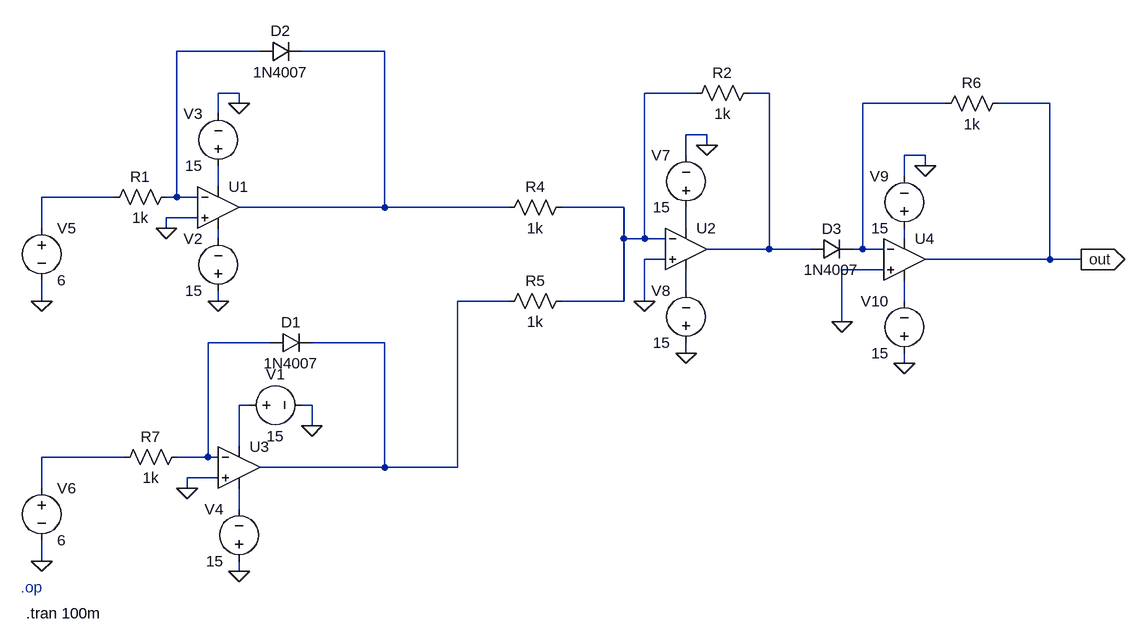
[diagram p0: schematic Day6_Analog Multiplier_OpAmp.asc]
Day6_Analog Multiplier_OpAmp.asc, the LTspice schematic file:
Version 4.1
SHEET 1 1520 784
WIRE 160 -96 32 -96
WIRE 352 -96 224 -96
WIRE 128 -32 96 -32
WIRE 832 -32 752 -32
WIRE 944 -32 912 -32
WIRE 128 -16 128 -32
WIRE 1216 -16 1088 -16
WIRE 1376 -16 1296 -16
WIRE 96 0 96 -32
WIRE 848 32 816 32
WIRE 848 48 848 32
WIRE 816 64 816 32
WIRE 1184 64 1152 64
WIRE 1184 80 1184 64
WIRE 1152 96 1152 64
WIRE 96 112 96 80
WIRE -64 128 -176 128
WIRE 32 128 32 -96
WIRE 32 128 16 128
WIRE 64 128 32 128
WIRE 352 144 352 -96
WIRE 352 144 128 144
WIRE 544 144 352 144
WIRE 720 144 624 144
WIRE 64 160 16 160
WIRE -176 176 -176 128
WIRE 16 176 16 160
WIRE 816 176 816 144
WIRE 96 192 96 176
WIRE 720 192 720 144
WIRE 752 192 752 -32
WIRE 752 192 720 192
WIRE 784 192 752 192
WIRE 1152 192 1152 176
WIRE 944 208 944 -32
WIRE 944 208 848 208
WIRE 1008 208 944 208
WIRE 1088 208 1088 -16
WIRE 1088 208 1072 208
WIRE 1120 208 1088 208
WIRE 784 224 752 224
WIRE 1376 224 1376 -16
WIRE 1376 224 1184 224
WIRE 1424 224 1376 224
WIRE 1120 240 1056 240
WIRE 816 272 816 240
WIRE -176 288 -176 256
WIRE 96 288 96 272
WIRE 544 288 464 288
WIRE 720 288 720 192
WIRE 720 288 624 288
WIRE 752 288 752 224
WIRE 1152 288 1152 256
WIRE 1056 320 1056 240
WIRE 176 352 80 352
WIRE 352 352 240 352
WIRE 816 368 816 352
WIRE 1152 384 1152 368
WIRE 144 448 128 448
WIRE 240 448 224 448
WIRE 240 480 240 448
WIRE 128 512 128 448
WIRE -48 528 -176 528
WIRE 80 528 80 352
WIRE 80 528 32 528
WIRE 96 528 80 528
WIRE 352 544 352 352
WIRE 352 544 160 544
WIRE 464 544 464 288
WIRE 464 544 352 544
WIRE 96 560 48 560
WIRE -176 576 -176 528
WIRE 48 576 48 560
WIRE 128 608 128 576
WIRE -176 688 -176 656
WIRE 128 704 128 688
FLAG 128 -16 0
FLAG 16 176 0
FLAG 128 704 0
FLAG 48 576 0
FLAG 240 480 0
FLAG -176 288 0
FLAG -176 688 0
FLAG 96 288 0
FLAG 848 48 0
FLAG 752 288 0
FLAG 816 368 0
FLAG 1424 224 out
IOPIN 1424 224 Out
FLAG 1184 80 0
FLAG 1152 384 0
FLAG 1056 320 0
SYMBOL OpAmps\\UniversalOpAmp2 96 144 R0
SYMATTR InstName U1
SYMBOL res 32 112 R90
WINDOW 0 0 56 VBottom 2
WINDOW 3 32 56 VTop 2
SYMATTR InstName R1
SYMATTR Value 1k
SYMBOL voltage 96 96 R180
WINDOW 0 24 96 Left 2
WINDOW 3 24 16 Left 2
WINDOW 123 0 0 Left 0
WINDOW 39 0 0 Left 0
SYMATTR InstName V3
SYMATTR Value 15
SYMBOL OpAmps\\UniversalOpAmp2 128 544 R0
SYMATTR InstName U3
SYMBOL voltage 128 704 R180
WINDOW 0 24 96 Left 2
WINDOW 3 24 16 Left 2
WINDOW 123 0 0 Left 0
WINDOW 39 0 0 Left 0
SYMATTR InstName V4
SYMATTR Value 15
SYMBOL res 48 512 R90
WINDOW 0 0 56 VBottom 2
WINDOW 3 32 56 VTop 2
SYMATTR InstName R7
SYMATTR Value 1k
SYMBOL voltage 128 448 R270
WINDOW 0 32 56 VTop 2
WINDOW 3 -32 56 VBottom 2
WINDOW 123 0 0 Left 0
WINDOW 39 0 0 Left 0
SYMATTR InstName V1
SYMATTR Value 15
SYMBOL res 640 272 R90
WINDOW 0 0 56 VBottom 2
WINDOW 3 32 56 VTop 2
SYMATTR InstName R5
SYMATTR Value 1k
SYMBOL voltage -176 160 R0
WINDOW 123 0 0 Left 0
WINDOW 39 0 0 Left 0
SYMATTR InstName V5
SYMATTR Value 6
SYMBOL voltage -176 560 R0
WINDOW 123 0 0 Left 0
WINDOW 39 0 0 Left 0
SYMATTR InstName V6
SYMATTR Value 6
SYMBOL diode 176 368 R270
WINDOW 0 32 32 VTop 2
WINDOW 3 0 32 VBottom 2
SYMATTR InstName D1
SYMATTR Value 1N4007
SYMBOL voltage 96 288 R180
WINDOW 0 24 96 Left 2
WINDOW 3 24 16 Left 2
WINDOW 123 0 0 Left 0
WINDOW 39 0 0 Left 0
SYMATTR InstName V2
SYMATTR Value 15
SYMBOL res 640 128 R90
WINDOW 0 0 56 VBottom 2
WINDOW 3 32 56 VTop 2
SYMATTR InstName R4
SYMATTR Value 1k
SYMBOL OpAmps\\UniversalOpAmp2 816 208 R0
SYMATTR InstName U2
SYMBOL voltage 816 160 R180
WINDOW 0 24 96 Left 2
WINDOW 3 24 16 Left 2
WINDOW 123 0 0 Left 0
WINDOW 39 0 0 Left 0
SYMATTR InstName V7
SYMATTR Value 15
SYMBOL diode 160 -80 R270
WINDOW 0 32 32 VTop 2
WINDOW 3 0 32 VBottom 2
SYMATTR InstName D2
SYMATTR Value 1N4007
SYMBOL res 928 -48 R90
WINDOW 0 0 56 VBottom 2
WINDOW 3 32 56 VTop 2
SYMATTR InstName R2
SYMATTR Value 1k
SYMBOL diode 1008 224 R270
WINDOW 0 32 32 VTop 2
WINDOW 3 0 32 VBottom 2
SYMATTR InstName D3
SYMATTR Value 1N4007
SYMBOL voltage 816 368 R180
WINDOW 0 24 96 Left 2
WINDOW 3 24 16 Left 2
WINDOW 123 0 0 Left 0
WINDOW 39 0 0 Left 0
SYMATTR InstName V8
SYMATTR Value 15
SYMBOL OpAmps\\UniversalOpAmp2 1152 224 R0
SYMATTR InstName U4
SYMBOL res 1312 -32 R90
WINDOW 0 0 56 VBottom 2
WINDOW 3 32 56 VTop 2
SYMATTR InstName R6
SYMATTR Value 1k
SYMBOL voltage 1152 192 R180
WINDOW 0 24 96 Left 2
WINDOW 3 24 16 Left 2
WINDOW 123 0 0 Left 0
WINDOW 39 0 0 Left 0
SYMATTR InstName V9
SYMATTR Value 15
SYMBOL voltage 1152 384 R180
WINDOW 0 24 96 Left 2
WINDOW 3 24 16 Left 2
WINDOW 123 0 0 Left 0
WINDOW 39 0 0 Left 0
SYMATTR InstName V10
SYMATTR Value 15
TEXT -208 728 Left 2 ;.op
TEXT -200 768 Left 2 !.tran 100m

The netlist it stands for:
* Day6_Analog Multiplier_OpAmp.asc
X§U1 0 N001 N006 N009 N002 level2 Avol=1Meg GBW=10Meg Slew=10Meg Ilimit=25m Rail=0 Vos=0 En=0 Enk=0 In=0 Ink=0 Rin=500Meg  ; pins In+ In- V+ V- OUT
R1 N001 N007 1k
V3 N006 0 15
X§U3 0 N014 N015 N017 N012 level2 Avol=1Meg GBW=10Meg Slew=10Meg Ilimit=25m Rail=0 Vos=0 En=0 Enk=0 In=0 Ink=0 Rin=500Meg  ; pins In+ In- V+ V- OUT
V4 0 N017 15
R7 N014 N016 1k
V1 N015 0 15
R5 N003 N012 1k
V5 N007 0 6
V6 N016 0 6
D1 N014 N012 1N4007
V2 0 N009 15
R4 N003 N002 1k
X§U2 0 N003 N008 N011 N004 level2 Avol=1Meg GBW=10Meg Slew=10Meg Ilimit=25m Rail=0 Vos=0 En=0 Enk=0 In=0 Ink=0 Rin=500Meg  ; pins In+ In- V+ V- OUT
V7 N008 0 15
D2 N001 N002 1N4007
R2 N004 N003 1k
D3 N004 N005 1N4007
V8 0 N011 15
X§U4 0 N005 N010 N013 out level2 Avol=1Meg GBW=10Meg Slew=10Meg Ilimit=25m Rail=0 Vos=0 En=0 Enk=0 In=0 Ink=0 Rin=500Meg  ; pins In+ In- V+ V- OUT
R6 out N005 1k
V9 N010 0 15
V10 0 N013 15
.model D D
.lib standard.dio
* .op
.tran 100m
.lib UniversalOpAmp2.lib
.backanno
.end